# EasyEDA Pro project esp32c3.eprj

# Schematic ESP32C3V1
Create Date: 2024-02-20; Page Name: P1; Project Name: esp32c3; Schematic Name: ESP32C3V1; Update Date: 2024-02-21; Company: 嘉立创EDA; Page Size: A4; Version: V1.0
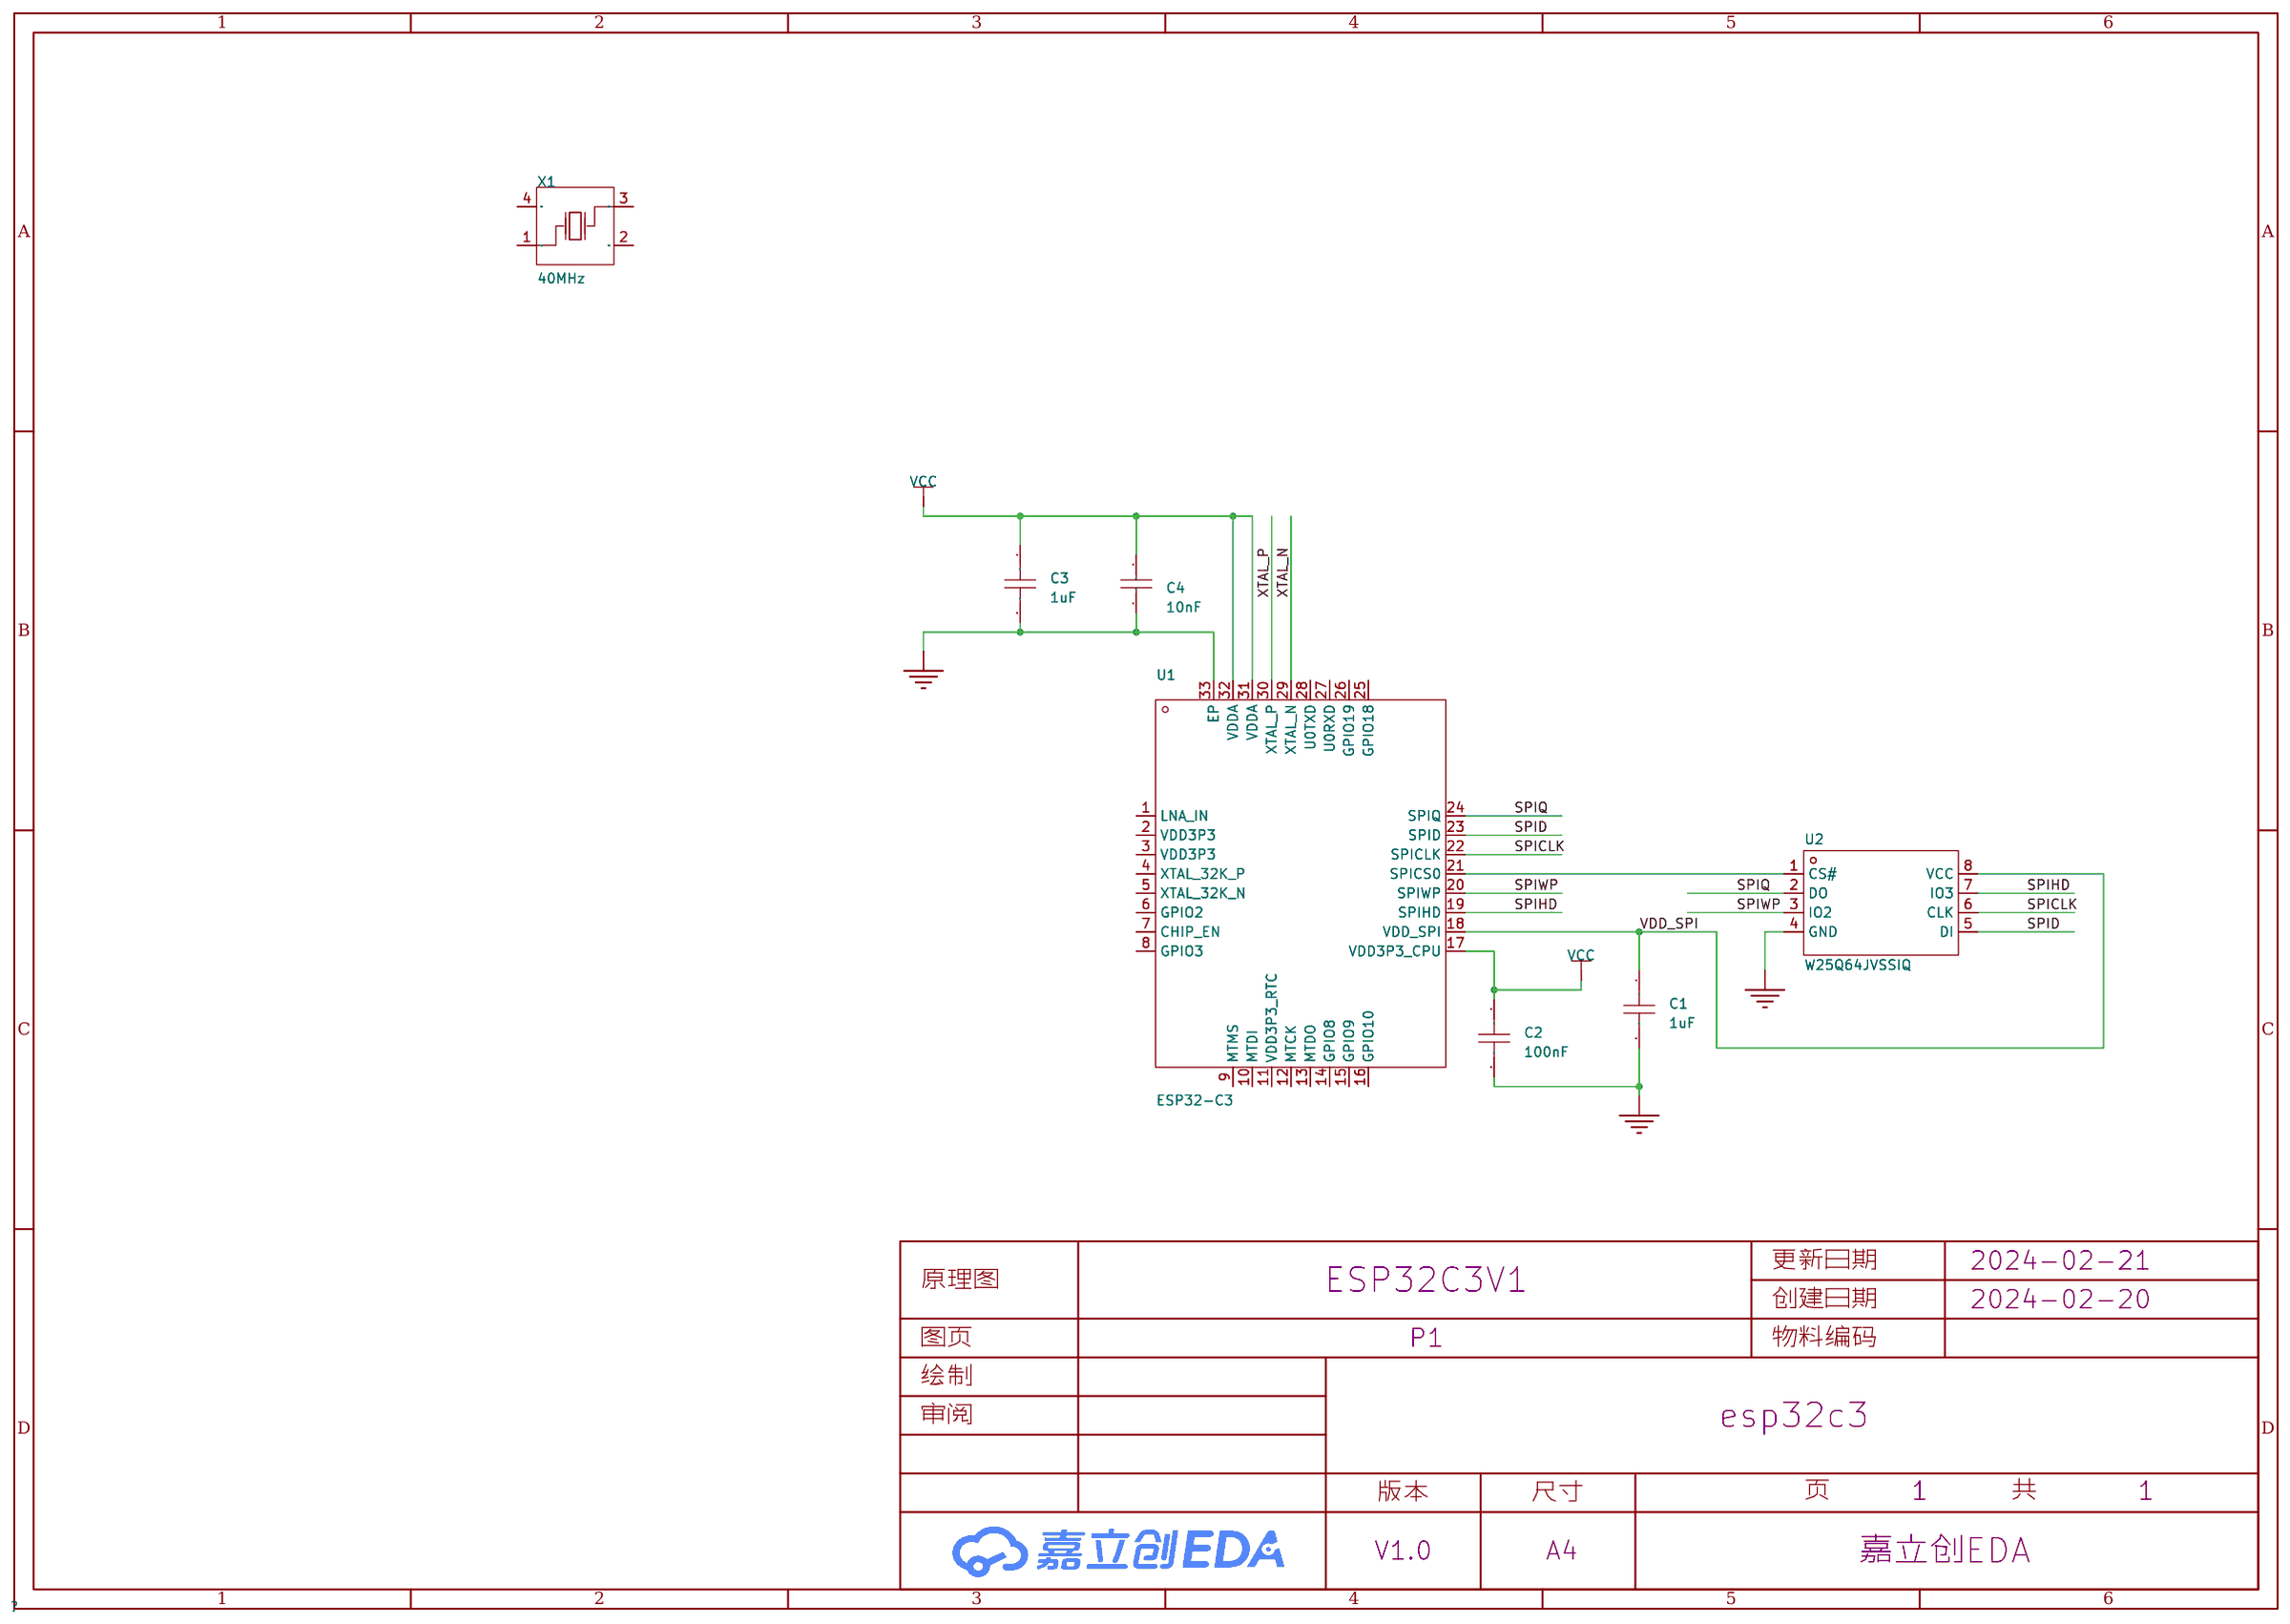
[diagram p0: schematic sheet]

## Parts
C1  1uF  [C0603]
C2  100nF  [C0603]
C3  1uF  [C0603]
C4  10nF  [C0603]
U1  ESP32-C3  [QFN-32_L5.0-W5.0-P0.50-TL-EP3.7]
U2  W25Q64JVSSIQ  [SOP-8_L5.3-W5.3-P1.27-LS8.0-BL]
X1  40MHz  [OSC-SMD_4P-L3.2-W2.5-BL_SIT8008BI]

## Library data of the parts
C1 C3 = CL10A105KB8NNNC: 容值:1uF;精度:±10%;额定电压:50V;材质(温度系数):X5R;; LCSC Part Name: 1uF ±10% 50V; Supplier Part: C15849; Manufacturer: SAMSUNG(三星); Supplier Footprint: 0603; JLCPCB Part Class: 基础库; Datasheet: https://atta.szlcsc.com/upload/public/pdf/source/20160218/1457707763339.pdf; Supplier: LCSC; Tolerance: ±10%; Voltage Rated: 50V; Temperature Coefficient: X5R
C2 = CC0603KRX7R9BB104: 容值:100nF;精度:±10%;额定电压:50V;材质(温度系数):X7R;; LCSC Part Name: 100nF ±10% 50V; Supplier Part: C14663; Manufacturer: YAGEO(国巨); Supplier Footprint: 0603; JLCPCB Part Class: 基础库; Datasheet: https://atta.szlcsc.com/upload/public/pdf/source/20180910/C282072_33301C7F631E79921B82A8DAC6BCC5B3.pdf; Supplier: LCSC; Tolerance: ±10%; Voltage Rated: 50V; Temperature Coefficient: X7R
C4 = CC0603KRX7R9BB103: 容值:10nF;精度:±10%;额定电压:50V;材质(温度系数):X7R;; LCSC Part Name: 10nF ±10% 50V; Supplier Part: C100042; Manufacturer: YAGEO(国巨); Supplier Footprint: 0603; JLCPCB Part Class: 扩展库; Datasheet: https://atta.szlcsc.com/upload/public/pdf/source/20181008/C309510_22F155564471FAF6A489F7D68F34234E.pdf; Supplier: LCSC; Tolerance: ±10%; Voltage Rated: 50V; Temperature Coefficient: X7R
U1 = ESP32-C3: CPU内核:RISC-V;RAM总容量:400KB;GPIO端口数量:22;工作电压范围:3V~3.6V;CPU最大主频:160MHz;程序存储器类型:-;; Supplier Part: C2838500; Manufacturer: ESPRESSIF(乐鑫); Supplier Footprint: QFN-32-EP(5x5); JLCPCB Part Class: 扩展库; Datasheet: https://atta.szlcsc.com/upload/public/pdf/source/20231220/86199E4714F7A99F6AA9401EA48CDBDA.pdf; Supplier: LCSC; CPU Core: RISC-V; RAM Size: 400KB; GPIO Ports Number: 22; Operating Voltage Range: 3V~3.6V; CPU Maximum Speed: 160MHz; Operating Temperature Range: -40℃~+105℃; ADC (Bit): 12bit; UART/USART: 2; I2C: 1; I2S: 1; SPI: 3; Peripheral/Function: 蓝牙协议栈；片载温度传感器；真随机数发生器；DMA；看门狗；WIFI协议栈；硬件密码算法引擎；54位Timer；PWM；RTC实时时钟; communication protocol: 蓝牙协议；WIFI协议; Watchdog: 有; Real-Time Clock: 有; Direct Memory Access: 有
U2 = W25Q64JVSSIQ_C83140: 64M-bit/8M-byte FLASH芯片,SPI接口 133MHz(266/532MHz Dual/Quad-SPI) 比W25Q64FVSSIG更高速度; Supplier Part: C83140; Manufacturer: WINBOND(华邦); Supplier Footprint: SOP-8-208mil; JLCPCB Part Class: 扩展库; Datasheet: https://atta.szlcsc.com/upload/public/pdf/source/20161110/1478742546019.pdf; Supplier: LCSC
X1 = X322540MPB4SI: 晶振类型:贴片晶振;频率:40MHz;常温频差:±10ppm;外接负载电容:15pF;频率稳定度(全温):±20ppm;; LCSC Part Name: 40MHz ±10ppm 15pF; Supplier Part: C9010; Manufacturer: YXC(扬兴晶振); Supplier Footprint: SMD3225-4P; JLCPCB Part Class: 扩展库; Datasheet: https://atta.szlcsc.com/upload/public/pdf/source/20240329/19D5F850207469550BEB00D7DFEDBC7A.pdf; Supplier: LCSC; Crystal Type: 贴片晶振; Normal temperature Frequency Tolerance: ±10ppm; External load capacitor: 15pF; Frequency Stability(Full temperature range): ±20ppm; Operating Temperature: -40℃~+85℃

## Nets
GND: C1.2 C2.2 C3.2 C4.2 U1.33(EP) U2.4(GND)
VCC: C2.1 C3.1 C4.1 U1.17(VDD3P3_CPU) U1.31(VDDA) U1.32(VDDA)
VDD_SPI: C1.1 U1.18(VDD_SPI) U2.8(VCC)
SPICLK: U1.22(SPICLK) U2.6(CLK)
SPID: U1.23(SPID) U2.5(DI)
SPIHD: U1.19(SPIHD) U2.7(IO3)
SPIQ: U1.24(SPIQ) U2.2(DO)
SPIWP: U1.20(SPIWP) U2.3(IO2)
XTAL_N: U1.29(XTAL_N)
XTAL_P: U1.30(XTAL_P)
Net-(U1-21): U1.21(SPICS0) U2.1(CS#)

Not connected (* = marked no-connect by the designer): U1 1(LNA_IN) 2(VDD3P3) 3(VDD3P3) 4(XTAL_32K_P) 5(XTAL_32K_N) 6(GPIO2) 7(CHIP_EN) 8(GPIO3) 9(MTMS) 10(MTDI) 11(VDD3P3_RTC) 12(MTCK) 13(MTDO) 14(GPIO8) 15(GPIO9) 16(GPIO10) 25(GPIO18) 26(GPIO19) 27(U0RXD) 28(U0TXD); X1 1(OSC1) 2(GND) 3(OSC2) 4(GND)

# Schematic ESP32C3FN4V1
Create Date: 2024-02-20; Page Name: P1; Project Name: esp32c3; Schematic Name: ESP32C3FN4V1; Update Date: 2024-02-21; Company: 嘉立创EDA; Page Size: A4; Version: V1.0
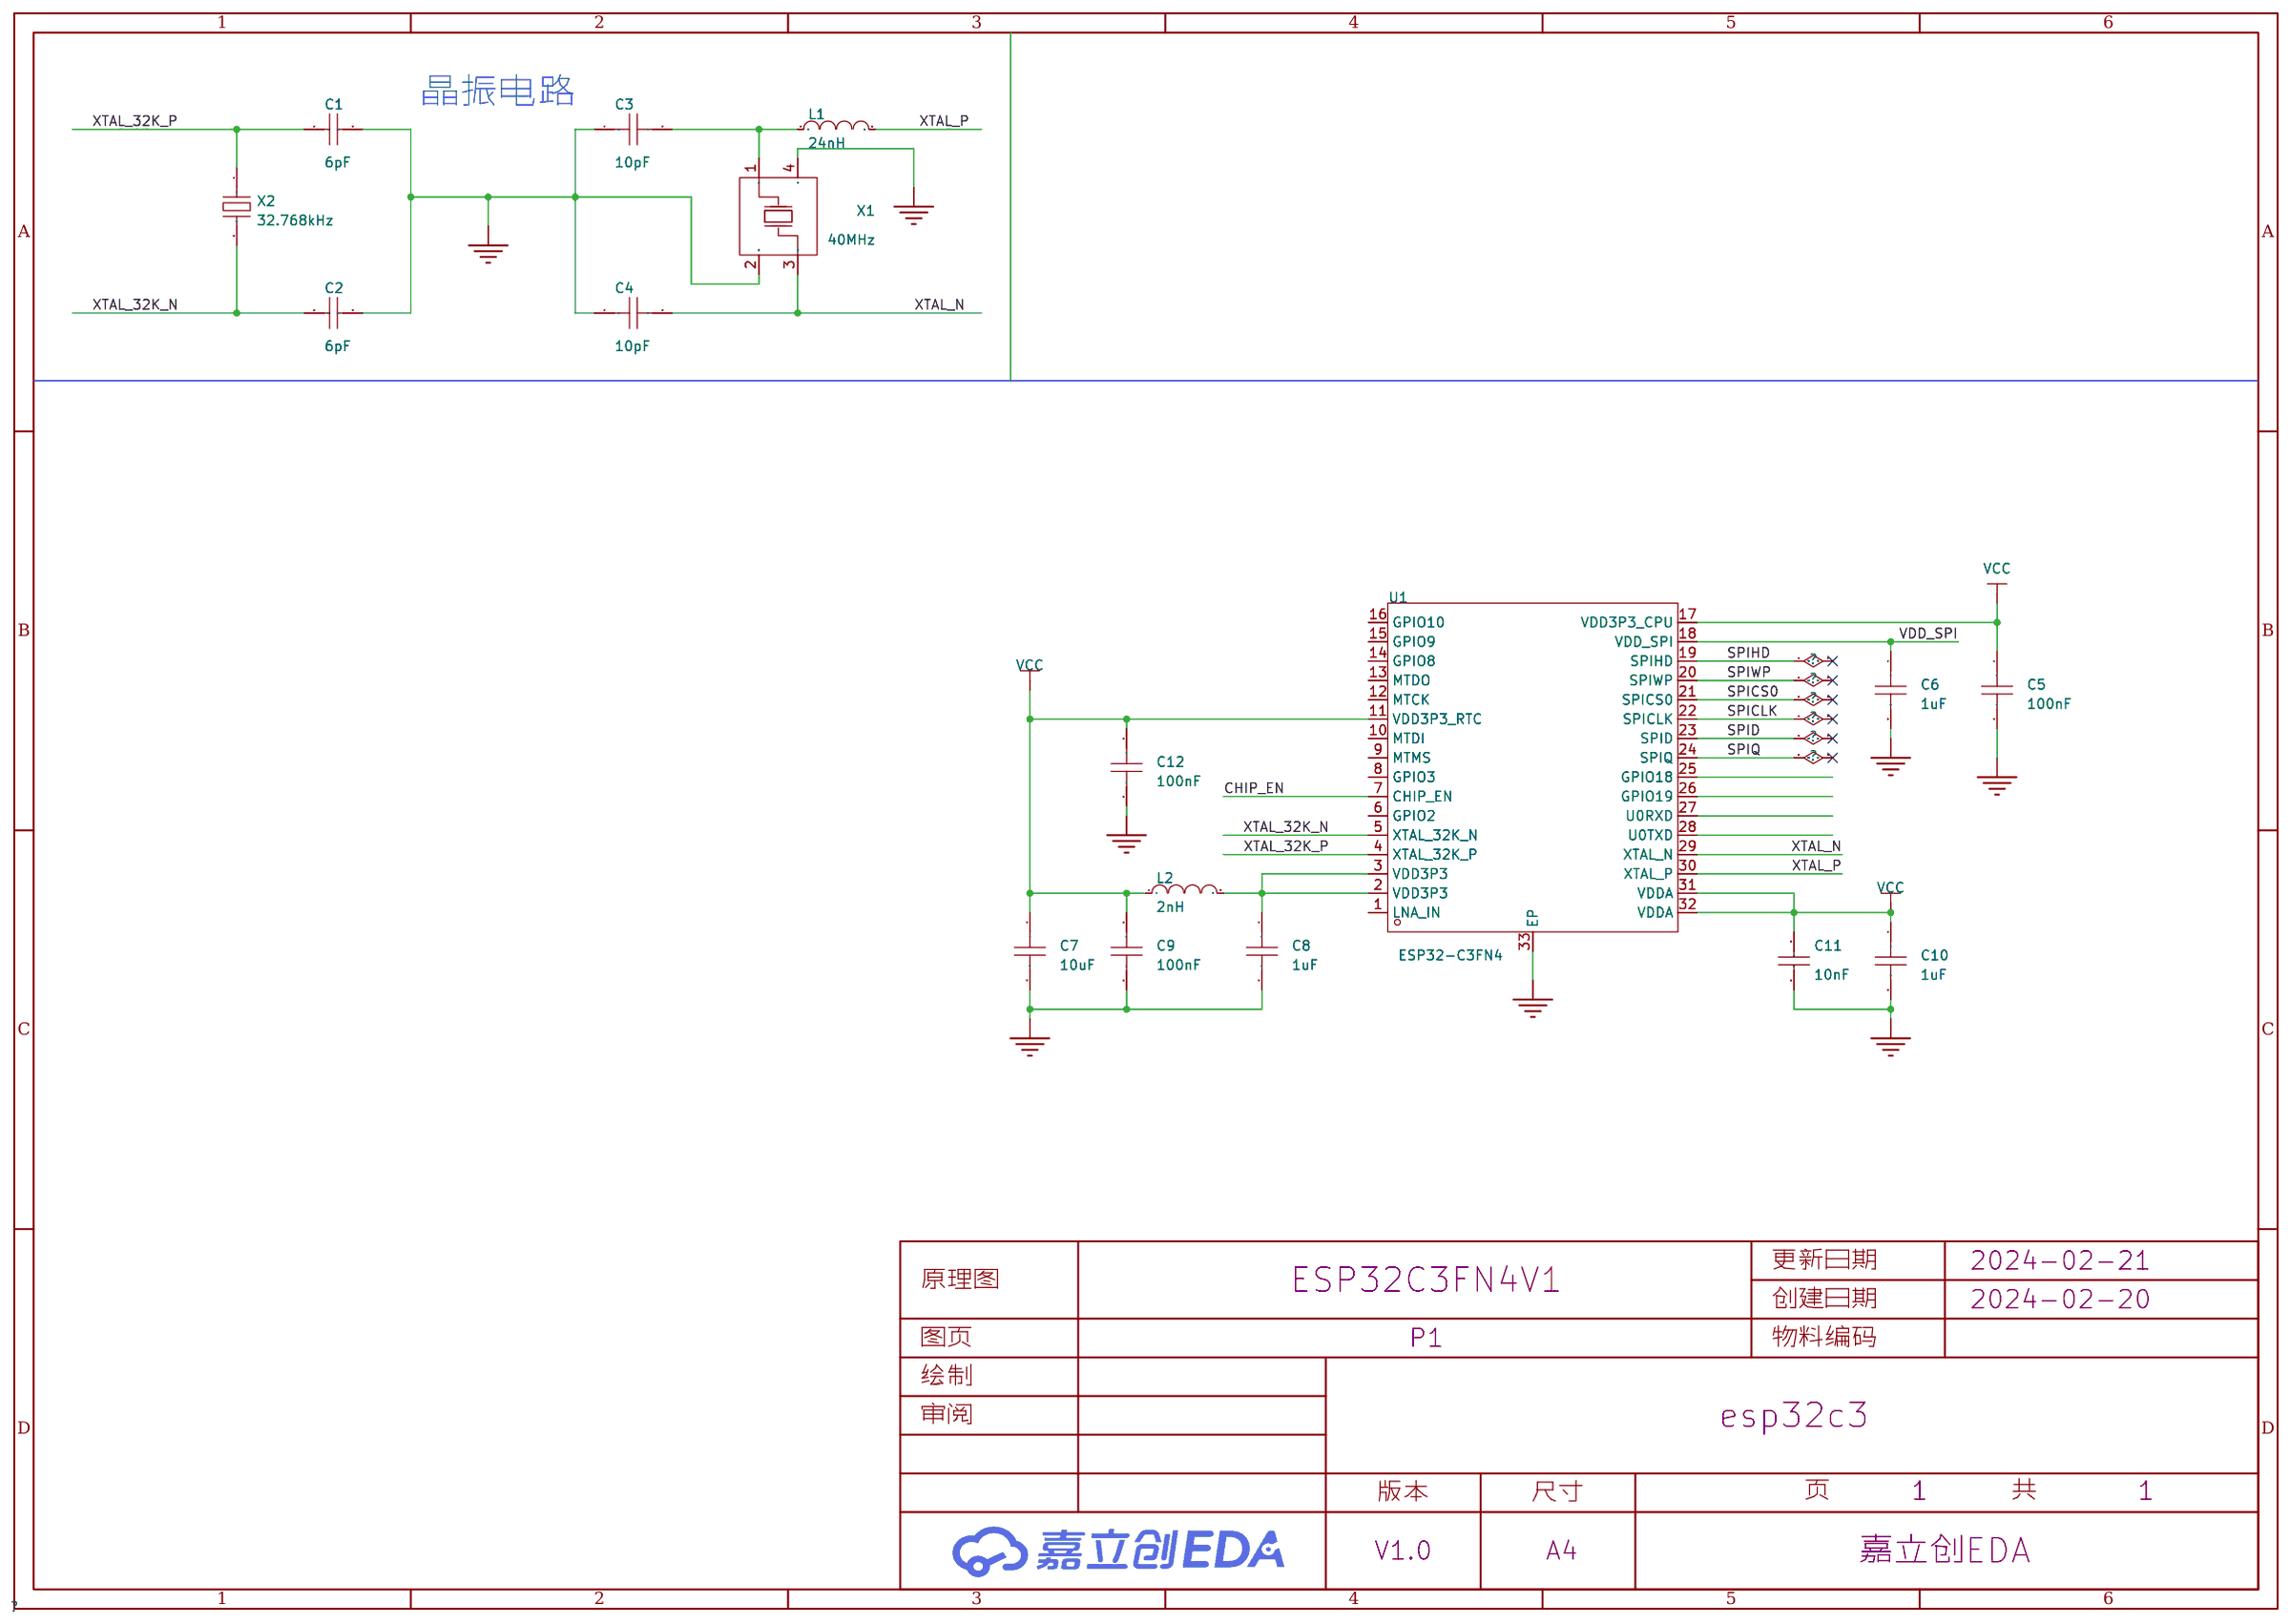
[diagram p1: schematic sheet]

## Parts
C1  6pF  [C0603]
C2  6pF  [C0603]
C3  10pF  [C0402]
C4  10pF  [C0402]
C5  100nF  [C0603]
C6  1uF  [C0603]
C7  10uF  [C0603]
C8  1uF  [C0603]
C9  100nF  [C0603]
C10  1uF  [C0603]
C11  10nF  [C0603]
C12  100nF  [C0603]
L1  24nH  [IND-SMD_L1.2-W0.6]
L2  2nH  [L0402]
U1  ESP32-C3FN4  [VFQFN-32_L5.0-W5.0-P0.50-TL-EP3.7]
X1  40MHz  [CRYSTAL-SMD_4P-L3.2-W2.5-BL]
X2  32.768kHz  [OSC-SMD_L3.2-W1.5]

## Library data of the parts
C1 C2 = 0603CG6R0C500NT: 容值:6pF;额定电压:50V;材质(温度系数):C0G;; LCSC Part Name: 6pF 50V; Supplier Part: C37474; Manufacturer: FH(风华); Supplier Footprint: 0603; JLCPCB Part Class: 扩展库; Datasheet: https://atta.szlcsc.com/upload/public/pdf/source/20200305/C486355_26A10D38EF8C2A5C37091D0039909270.pdf; Supplier: LCSC; Voltage Rated: 50V; Temperature Coefficient: C0G
C3 C4 = CL05C100JB5NNNC: 容值:10pF;精度:±5%;额定电压:50V;材质(温度系数):C0G;; LCSC Part Name: 10pF ±5% 50V; Supplier Part: C32949; Manufacturer: SAMSUNG(三星); Supplier Footprint: 0402; JLCPCB Part Class: 基础库; Datasheet: https://atta.szlcsc.com/upload/public/pdf/source/20160218/1457707763339.pdf; Supplier: LCSC; Tolerance: ±5%; Voltage Rated: 50V; Temperature Coefficient: C0G
C5 C9 C12 = CC0603KRX7R9BB104: 容值:100nF;精度:±10%;额定电压:50V;材质(温度系数):X7R;; LCSC Part Name: 100nF ±10% 50V; Supplier Part: C14663; Manufacturer: YAGEO(国巨); Supplier Footprint: 0603; JLCPCB Part Class: 基础库; Datasheet: https://atta.szlcsc.com/upload/public/pdf/source/20180910/C282072_33301C7F631E79921B82A8DAC6BCC5B3.pdf; Supplier: LCSC; Tolerance: ±10%; Voltage Rated: 50V; Temperature Coefficient: X7R
C6 C8 C10 = CL10A105KB8NNNC: 容值:1uF;精度:±10%;额定电压:50V;材质(温度系数):X5R;; LCSC Part Name: 1uF ±10% 50V; Supplier Part: C15849; Manufacturer: SAMSUNG(三星); Supplier Footprint: 0603; JLCPCB Part Class: 基础库; Datasheet: https://atta.szlcsc.com/upload/public/pdf/source/20160218/1457707763339.pdf; Supplier: LCSC; Tolerance: ±10%; Voltage Rated: 50V; Temperature Coefficient: X5R
C7 = CL10A106KP8NNNC: 容值:10uF;精度:±10%;额定电压:10V;材质(温度系数):X5R;; LCSC Part Name: 10uF ±10% 10V; Supplier Part: C19702; Manufacturer: SAMSUNG(三星); Supplier Footprint: 0603; JLCPCB Part Class: 基础库; Datasheet: https://atta.szlcsc.com/upload/public/pdf/source/20160218/1457707763339.pdf; Supplier: LCSC; Tolerance: ±10%; Voltage Rated: 10V; Temperature Coefficient: X5R
C11 = CC0603KRX7R9BB103: 容值:10nF;精度:±10%;额定电压:50V;材质(温度系数):X7R;; LCSC Part Name: 10nF ±10% 50V; Supplier Part: C100042; Manufacturer: YAGEO(国巨); Supplier Footprint: 0603; JLCPCB Part Class: 扩展库; Datasheet: https://atta.szlcsc.com/upload/public/pdf/source/20181008/C309510_22F155564471FAF6A489F7D68F34234E.pdf; Supplier: LCSC; Tolerance: ±10%; Voltage Rated: 50V; Temperature Coefficient: X7R
L1 = SCW1005C24NJST: 电感值:24nH;精度:±5%;额定电流:330mA;饱和电流(Isat):-;直流电阻(DCR):360mΩ;; LCSC Part Name: 24nH ±5%; Supplier Part: C330863; Manufacturer: Sunltech(韩国顺磁); Supplier Footprint: 0402; JLCPCB Part Class: 扩展库; Datasheet: https://atta.szlcsc.com/upload/public/pdf/source/20181210/C330913_8358B696A3C93E18381067295F025C3C.pdf; Supplier: LCSC; Tolerance: ±5%; Rated Current: 330mA; DC Resistance (DCR): 360mΩ
L2 = LQG15HS2N0S02D: 电感值:2nH;精度:-;额定电流:900mA;饱和电流(Isat):-;直流电阻(DCR):90mΩ;; Supplier Part: C18216; Manufacturer: muRata(村田); Supplier Footprint: 0402; JLCPCB Part Class: 扩展库; Datasheet: https://atta.szlcsc.com/upload/public/pdf/source/20180326/C97997_1F0DD99169B70C50822BB5034156F8BC.pdf; Supplier: LCSC; Rated Current: 900mA; DC Resistance (DCR): 90mΩ; Q @ Freq: 8@100MHz; Frequency - Self Resonant: 6GHz
U1 = ESP32-C3FN4_C5143572: Supplier Part: C5143572; Manufacturer: ESPRESSIF(乐鑫); Supplier Footprint: QFN-32(5x5); JLCPCB Part Class: 扩展库; Datasheet: https://atta.szlcsc.com/upload/public/pdf/source/20220602/861C2DDE1DCA4B324FDF5F31A2F47564.pdf; Supplier: LCSC
X1 = S3240000121040: 晶振类型:贴片晶振;频率:40MHz;常温频差:±10ppm;外接负载电容:12pF;; LCSC Part Name: 40MHz ±10ppm 12pF; Supplier Part: C426989; Manufacturer: JGHC(晶光华); Supplier Footprint: SMD3225-4P; JLCPCB Part Class: 扩展库; Datasheet: https://atta.szlcsc.com/upload/public/pdf/source/20191012/C431172_99BCDFC5E39E114929AE7F9C9DED2B9F.pdf; Supplier: LCSC; Crystal Type: 贴片晶振; Normal temperature Frequency Tolerance: ±10ppm; External load capacitor: 12pF; Equivalent Series Resistance (ESR): 40Ω; Operating Temperature: -40℃~+85℃
X2 = X321532768KGD2SI: 晶振类型:贴片晶振;频率:32.768kHz;常温频差:±20ppm;外接负载电容:12.5pF;频率稳定度(全温):-;; LCSC Part Name: 32.768kHz ±20ppm 12.5pF; Supplier Part: C620155; Manufacturer: YXC(扬兴晶振); Supplier Footprint: SMD3215-2P; JLCPCB Part Class: 扩展库; Datasheet: https://atta.szlcsc.com/upload/public/pdf/source/20240329/3A7650FD985DD0DE85694D3785AB4916.pdf; Supplier: LCSC; Crystal Type: 贴片晶振; Normal temperature Frequency Tolerance: ±20ppm; External load capacitor: 12.5pF; Operating Temperature: -40℃~+85℃

## Nets
GND: C1.2 C2.2 C3.1 C4.1 C5.2 C6.2 C7.2 C8.2 C9.2 C10.2 C11.2 C12.2 U1.33(EP) X1.2(GND) X1.4(GND)
VCC: C5.1 C7.1 C9.1 C10.1 C11.1 C12.1 L2.1 U1.11(VDD3P3_RTC) U1.17(VDD3P3_CPU) U1.31(VDDA) U1.32(VDDA)
VDD_SPI: C6.1 U1.18(VDD_SPI)
CHIP_EN: U1.7(CHIP_EN)
SPICLK: U1.22(SPICLK)
SPICS0: U1.21(SPICS0)
SPID: U1.23(SPID)
SPIHD: U1.19(SPIHD)
SPIQ: U1.24(SPIQ)
SPIWP: U1.20(SPIWP)
XTAL_32K_N: C2.1 U1.5(XTAL_32K_N) X2.2
XTAL_32K_P: C1.1 U1.4(XTAL_32K_P) X2.1
XTAL_N: C4.2 U1.29(XTAL_N) X1.3(OSC2)
XTAL_P: L1.2 U1.30(XTAL_P)
Net-(C3-2): C3.2 L1.1 X1.1(OSC1)
Net-(C8-1): C8.1 L2.2 U1.2(VDD3P3) U1.3(VDD3P3)

Not connected (* = marked no-connect by the designer): U1 1(LNA_IN) 6(GPIO2) 8(GPIO3) 9(MTMS) 10(MTDI) 12(MTCK) 13(MTDO) 14(GPIO8) 15(GPIO9) 16(GPIO10) 25(GPIO18) 26(GPIO19) 27(U0RXD) 28(U0TXD)

## Notes on the sheet
- 晶振电路
